# Altium project AT89S52精简开发板.PrjPCB
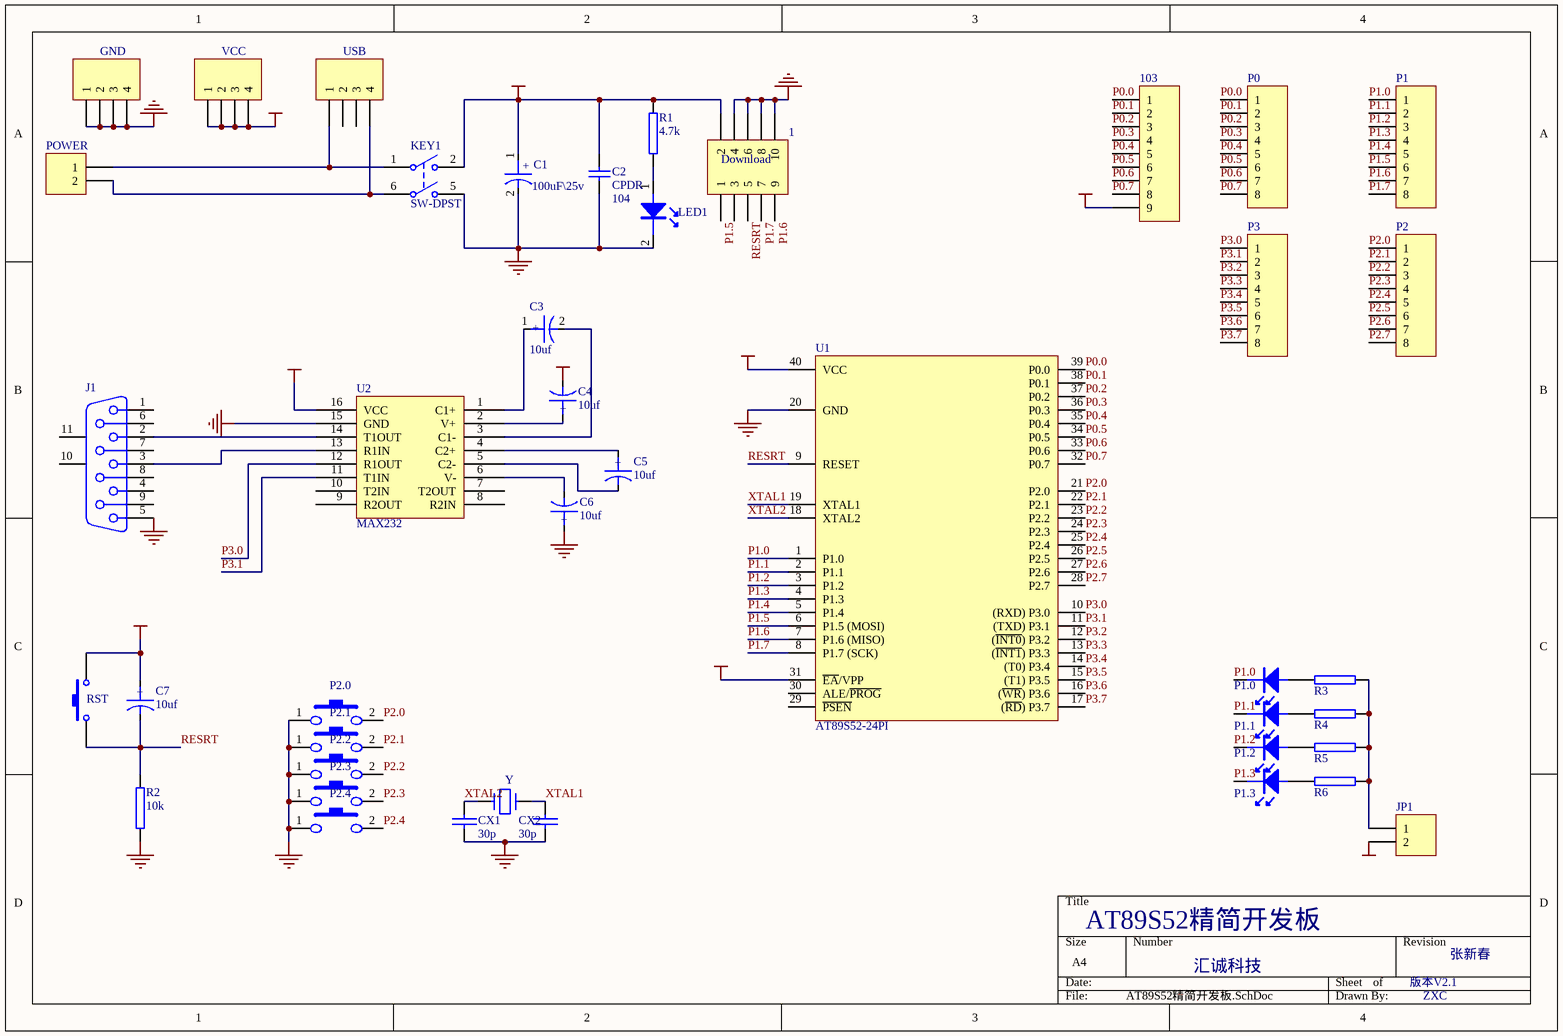
[diagram p0: AT89S52精简开发板.SchDoc]
1 sheet, 42 parts. Net scope: global (net labels, ports and power ports of the same name join across sheets).
Board file: AT89S52精简开发板.PCBDOC

## Sheet AT89S52精简开发板.SchDoc
size A4

### Parts
1  Download  [HDR-2x5]
103  (no value)  [HDR-9]
C1  100uF\25v  [C-DJ-6]
C2  CPDR  value 104  [CPDR]
C3  10uf  [C-DJ-4]
C4  10uf  [C-DJ-4]
C5  10uf  [C-DJ-4]
C6  10uf  [C-DJ-4]
C7  10uf  [C-DJ-4]
CX1  30p  [HDR1X2]
CX2  30p  [HDR1X2]
GND  (no value)  [HDR1X4]
J1  D Connector 9  [DSUB1.385-2H9]  (value not drawn)
JP1  (no value)  [HDR1X2]
KEY1  SW-DPST  [DPDT-6]
LED1  LED  [LED]  (value not drawn)
P0  (no value)  [HDR-8]
P1  (no value)  [HDR-8]
P1.0  LED  [HDR1X2]  (value not drawn)
P1.1  LED  [HDR1X2]  (value not drawn)
P1.2  LED  [HDR1X2]  (value not drawn)
P1.3  LED  [HDR1X2]  (value not drawn)
P2  (no value)  [HDR-8]
P2.0  key1  [an-6*6]  (value not drawn)
P2.1  key2  [an-6*6]  (value not drawn)
P2.2  key3  [an-6*6]  (value not drawn)
P2.3  key4  [an-6*6]  (value not drawn)
P2.4  key4  [an-6*6]  (value not drawn)
P3  (no value)  [HDR-8]
POWER  (no value)  [JK128]
R1  4.7k  [RSE]
R2  10k  [RSE]
R3  470  [RSE]  (value not drawn)
R4  470  [RSE]  (value not drawn)
R5  470  [RSE]  (value not drawn)
R6  470  [RSE]  (value not drawn)
RST  (no value)  [an-6*6]
U1  AT89S52-24PI  [DIP-40]
U2  MAX232  [DIP16]
USB  (no value)  [USB-5V]
VCC  (no value)  [HDR1X4]
Y1  Y  [JZ_ZC]

### Nets
GND: 1.4 1.6 1.8 1.10 C1.2 C2.1 C6.1 CX1.2 CX2.2 GND.1 GND.2 GND.3 GND.4 J1.5 KEY1.5(NO2) LED1.2(K) P2.0.1 P2.1.1 P2.2.1 P2.3.1 P2.4.1 R2.1 U1.20(GND) U2.15(GND)
VCC: 1.2 103.9 C1.1 C2.2 C4.2 C7.1 JP1.2 KEY1.2(NO1) R1.1 RST.1 U1.31(~{EA}/VPP) U1.40(VCC) U2.16(VCC) VCC.1 VCC.2 VCC.3 VCC.4
P0.0: 103.1 P0.1 U1.39(P0.0)
P0.1: 103.2 P0.2 U1.38(P0.1)
P0.2: 103.3 P0.3 U1.37(P0.2)
P0.3: 103.4 P0.4 U1.36(P0.3)
P0.4: 103.5 P0.5 U1.35(P0.4)
P0.5: 103.6 P0.6 U1.34(P0.5)
P0.6: 103.7 P0.7 U1.33(P0.6)
P0.7: 103.8 P0.8 U1.32(P0.7)
P1.0: P1.1 P1.0.2(K) U1.1(P1.0)
P1.1: P1.2 P1.1.2(K) U1.2(P1.1)
P1.2: P1.3 P1.2.2(K) U1.3(P1.2)
P1.3: P1.4 P1.3.2(K) U1.4(P1.3)
P1.4: P1.5 U1.5(P1.4)
P1.5: 1.1 P1.6 U1.6(P1.5_(MOSI))
P1.6: 1.9 P1.7 U1.7(P1.6_(MISO))
P1.7: 1.7 P1.8 U1.8(P1.7_(SCK))
P2.0: P2.1 P2.0.2 U1.21(P2.0)
P2.1: P2.2 P2.1.2 U1.22(P2.1)
P2.2: P2.3 P2.2.2 U1.23(P2.2)
P2.3: P2.4 P2.3.2 U1.24(P2.3)
P2.4: P2.5 P2.4.2 U1.25(P2.4)
P2.5: P2.6 U1.26(P2.5)
P2.6: P2.7 U1.27(P2.6)
P2.7: P2.8 U1.28(P2.7)
P3.0: P3.1 U1.10((RXD)_P3.0) U2.12(R1OUT)
P3.1: P3.2 U1.11((TXD)_P3.1) U2.11(T1IN)
P3.2: P3.3 U1.12((~{INT0})_P3.2)
P3.3: P3.4 U1.13((~{INT1})_P3.3)
P3.4: P3.5 U1.14((T0)_P3.4)
P3.5: P3.6 U1.15((T1)_P3.5)
P3.6: P3.7 U1.16((~{WR})_P3.6)
P3.7: P3.8 U1.17((~{RD})_P3.7)
RESRT: 1.5 C7.2 R2.2 RST.2 U1.9(RESET)
XTAL1: CX2.1 U1.19(XTAL1) Y1.1
XTAL2: CX1.1 U1.18(XTAL2) Y1.2
NetC3_1: C3.1 U2.1(C1+)
NetC3_2: C3.2 U2.3(C1-)
NetC4_1: C4.1 U2.2(V+)
NetC5_1: C5.1 U2.4(C2+)
NetC5_2: C5.2 U2.5(C2-)
NetC6_2: C6.2 U2.6(V-)
NetJ1_2: J1.2 U2.14(T1OUT)
NetJ1_3: J1.3 U2.13(R1IN)
NetJP1_1: JP1.1 R3.1 R4.1 R5.1 R6.1
NetKEY1_1: KEY1.1(COMMON1) POWER.1 USB.1
NetKEY1_6: KEY1.6(COMMON2) POWER.2 USB.4
NetLED1_1: LED1.1(A) R1.2
NetP1.0_1: P1.0.1(A) R3.2
NetP1.1_1: P1.1.1(A) R4.2
NetP1.2_1: P1.2.1(A) R5.2
NetP1.3_1: P1.3.1(A) R6.2

Not connected (* = marked no-connect by the designer): 1 3; J1 1 4 6 7 8 9 10(MH1) 11(MH2); U1 29(~{PSEN}) 30(ALE/~{PROG}); U2 7(T2OUT) 8(R2IN) 9(R2OUT) 10(T2IN); USB 2 3

### Notes on the sheet
- AT89S52精简开发板
- 汇诚科技
- 版本V2.1
- 张新春
- ZXC
- (in symbol CAPACITOR POL) +

### Library data of the parts
1 = Header 5X2: Header, 5-Pin, Dual row; Revision: 17-Jul-2002: Re-released for DXP Platform.; Publisher: Altium Limited
103 = PZ_9: 排针——9; LatestRevisionDate: 17-Jul-2002; LatestRevisionNote: Re-released for DXP Platform.; Publisher: Altium Limited
C1 C3-C7 = CAPACITOR POL: Capacitor
C2 = CPDR: 瓷片电容; Published: 8-Jun-2000; LatestRevisionDate: 17-Jul-2002; LatestRevisionNote: Re-released for DXP Platform.; Publisher: Altium Limited
CX1 CX2 = CAP: Capacitor
GND USB VCC = Header 4: Header, 4-Pin; Revision: 17-Jul-2002: Re-released for DXP Platform.; Publisher: Altium Limited
J1 = D Connector 9: Receptacle Assembly, 9 Position, Right Angle; Package Information: Latest Revision: O; Positions: 9; Published: 15-Jun-2001; Revision: 17-Jul-2002: Re-released for DXP Platform.; Datasheet: (1-Sep-1999); Package Reference: 788750; Publisher: Altium Limited; Orientation: Right Angle; Gender: Receptacle
JP1 POWER = Header 2: Header, 2-Pin; LatestRevisionDate: 17-Jul-2002; LatestRevisionNote: Re-released for DXP Platform.; Publisher: Altium Limited
KEY1 = SW-DPST: Double-Pole, Single-Throw Switch; Published: 24-Mar-1999; Revision: July-2002: Re-released for DXP Platform.; Publisher: Altium Limited
P0-P3 = PZ_8: 排针——8; LatestRevisionDate: 17-Jul-2002; LatestRevisionNote: Re-released for DXP Platform.; Publisher: Altium Limited
P2.0-P2.4 = key
R1-R6 = RES2
RST = SW-PB: Switch; Published: 24-Mar-1999; LatestRevisionDate: 17-Jul-2002; LatestRevisionNote: Re-released for DXP Platform.; Publisher: Altium Limited
U1 = AT89S52-P: 8 位微处理器/40引脚; 子类别: 微处理器; 发布者: 磊元工作室; 发布日期: 2003年8月18日; 制造商: Atmel Corporation; 类别: 集成电路; 元件名称（国标）: 8 位微处理器; 元件名称（英文）: 8-bit Microcontroller; 特性:存储器容量: Flash：8KB  ，RAM：256B; 特性:定时器/计数器: 3 个 16-bit
Y1 = CRYSTAL